# Altium project Carte_Mere.PrjPcb
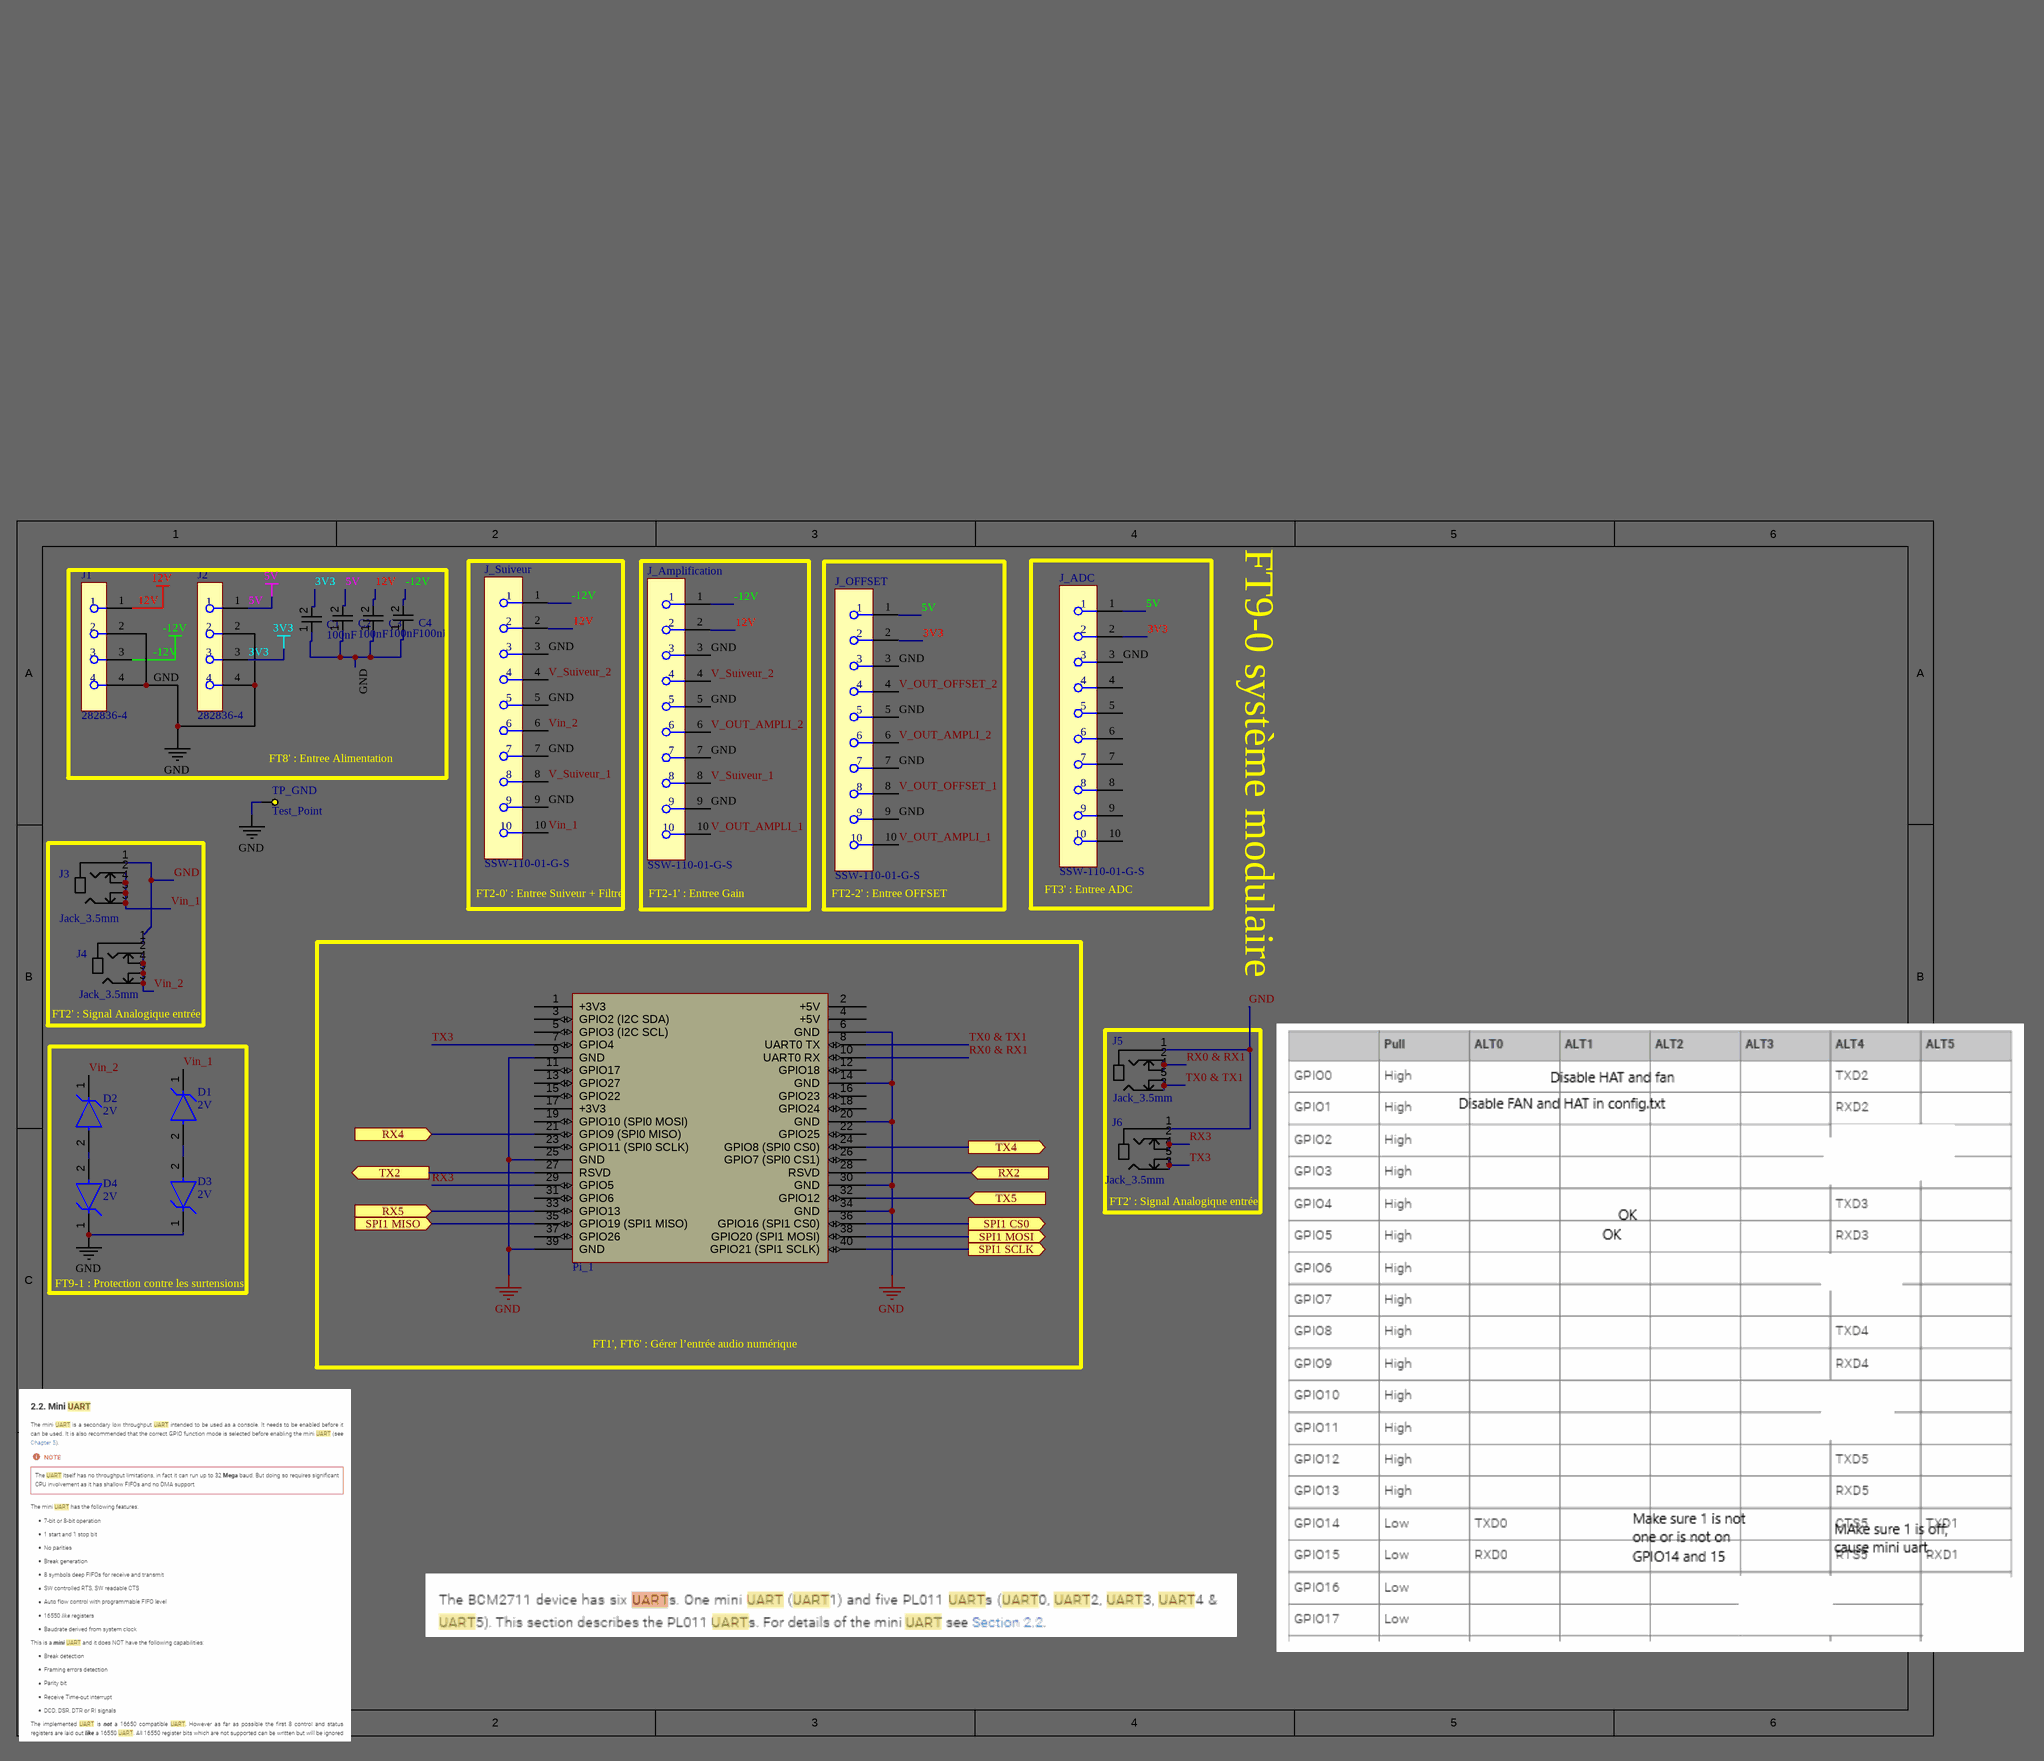
[diagram p0: CarteMere.SchDoc]
CAGE_CODE: ?????; CONTRACT_NUMBER: <CONTRACT NO>; DOC_NO_ASSY_DWG: <ASSY DWG NO>; DOC_NO_BOM: <BOM DOC NO>; DOC_NO_FAB_DWG: <FAB DWG NO>; DOC_NO_SCH_DWG: <SCH DWG NO>; PCB_2_DEC_TOL: +/-.01; PCB_3_DEC_TOL: +/-.010; PCB_ANG_TOL: +/-1/2; PCB_ASSEMBLY_NO: <PCB ASSY NO>; PCB_CHECKER: - -----; PCB_CHECKER_APP_DATE: --/--/----; PCB_DESIGNER: - -----; PCB_DESIGNER_APP_DATE: --/--/----; PCB_DWG_NO: <PCB DWG NO>; PCB_ENGINEER: - -----; PCB_ENGINEER_APP_DATE: --/--/----; PCB_PART_NUMBER: <PCB PN>; PCB_REV: A; SCH_REV: A
1 sheet, 20 parts. Net scope: flat (ports and power ports of the same name join across sheets).
Board file: CarteMere.PcbDoc

## Sheet CarteMere.SchDoc
size B; SheetNumber: 1; SheetTotal: 1; ENG_APP_DATE: --/--/--; DSN_APP_DATE: --/--/--; CHK_APP_DATE: --/--/--

### Parts
C1  value 100nF  [Cap_6.0%2A2.5%2A6mm]  (hidden comment: Cap_6.0*2.5*6mm)
C2  value 100nF  [Cap_6.0%2A2.5%2A6mm]  (hidden comment: Cap_6.0*2.5*6mm)
C3  value 100nF  [Cap_6.0%2A2.5%2A6mm]  (hidden comment: Cap_6.0*2.5*6mm)
C4  value 100nF  [Cap_6.0%2A2.5%2A6mm]  (hidden comment: Cap_6.0*2.5*6mm)
D1  value 2V  [Zener_Diode]  (hidden comment: ZENER_Diode)
D2  value 2V  [Zener_Diode]  (hidden comment: ZENER_Diode)
D3  value 2V  [Zener_Diode]  (hidden comment: ZENER_Diode)
D4  value 2V  [Zener_Diode]  (hidden comment: ZENER_Diode)
J1  282836-4  [FP-282836-4-MFG]
J2  282836-4  [FP-282836-4-MFG]
J3  Jack_3.5mm  [Jack_3.5mm_PCB_ 3poles/stereo]
J4  Jack_3.5mm  [Jack_3.5mm_PCB_ 3poles/stereo]
J5  Jack_3.5mm  [Jack_3.5mm_PCB_ 3poles/stereo]
J6  Jack_3.5mm  [Jack_3.5mm_PCB_ 3poles/stereo]
J_ADC  SSW-110-01-G-S  [FP-SSW-110-01-G-S-MFG]
J_Amplification  SSW-110-01-G-S  [FP-SSW-110-01-G-S-MFG]
J_OFFSET  SSW-110-01-G-S  [FP-SSW-110-01-G-S-MFG]
J_Suiveur  SSW-110-01-G-S  [FP-SSW-110-01-G-S-MFG]
Pi_1  GPIO_conn_RaspberyPi  [Pi_20x2_pins_Male]  (value not drawn)
TP_GND  Test_Point  [Test_Point_Hook]

### Blocks framed on the sheet
FT8' : Entree Alimentation: C1-C4 J1 J2
FT2-0' : Entree Suiveur + Filtre: J_Suiveur
FT2-1' : Entree Gain: J_Amplification
FT2-2' : Entree OFFSET: J_OFFSET
FT3' : Entree ADC: J_ADC
FT2' : Signal Analogique entrée: J3 J4
FT1', FT6' : Gérer l’entrée audio numérique: Pi_1
FT2' : Signal Analogique entrée: J5 J6
FT9-1 : Protection contre les surtensions: D1-D4

### Ports
RX2 (in), RX4 (in), RX5 (in), SPI1 CS0 (out), SPI1 MISO (in), SPI1 MOSI (out), SPI1 SCLK (out), TX2 (out), TX4 (out), TX5 (in)

### Nets
3V3: C1.2 J2.3 J_ADC.2 J_OFFSET.2
5V: C2.2 J2.1 J_ADC.1 J_OFFSET.1
12V: C3.2 J1.1 J_Amplification.2 J_Suiveur.2
-12V: C4.2 J1.3 J_Amplification.1 J_Suiveur.1
GND: C1.1 C2.1 C3.1 C4.1 D3.1(C) D4.1(C) J1.2 J1.4 J2.2 J2.4 J3.1 J4.1 J5.1 J6.1 J_ADC.3 J_Amplification.3 J_Amplification.5 J_Amplification.7 J_Amplification.9 J_OFFSET.3 J_OFFSET.5 J_OFFSET.7 J_OFFSET.9 J_Suiveur.3 J_Suiveur.5 J_Suiveur.7 J_Suiveur.9 Pi_1.6(GND) Pi_1.9(GND) Pi_1.14(GND) Pi_1.20(GND) Pi_1.25(GND) Pi_1.30(GND) Pi_1.34(GND) Pi_1.39(GND) TP_GND.Tp?
RX0 & RX1: J5.2 J5.4 Pi_1.10(UART0_RX)
RX3: J6.2 J6.4 Pi_1.29(GPIO5)
TX0 & TX1: J5.3 J5.5 Pi_1.8(UART0_TX)
TX3: J6.3 J6.5 Pi_1.7(GPIO4)
V_OUT_AMPLI_1: J_Amplification.10 J_OFFSET.10
V_OUT_AMPLI_2: J_Amplification.6 J_OFFSET.6
V_OUT_OFFSET_1: J_OFFSET.8
V_OUT_OFFSET_2: J_OFFSET.4
V_Suiveur_1: J_Amplification.8 J_Suiveur.8
V_Suiveur_2: J_Amplification.4 J_Suiveur.4
Vin_1: D1.1(C) J3.2 J3.3 J3.4 J3.5 J_Suiveur.10
Vin_2: D2.1(C) J4.2 J4.3 J4.4 J4.5 J_Suiveur.6
NetD1_2: D1.2(A) D3.2(A)
NetD2_2: D2.2(A) D4.2(A)
NetPi_1_21: Pi_1.21(GPIO9_(SPI0_MISO)) ; port RX4
NetPi_1_24: Pi_1.24(GPIO8_(SPI0_CS0)) ; port TX4
NetPi_1_27: Pi_1.27(RSVD) ; port TX2
NetPi_1_28: Pi_1.28(RSVD) ; port RX2
NetPi_1_32: Pi_1.32(GPIO12) ; port TX5
NetPi_1_33: Pi_1.33(GPIO13) ; port RX5
NetPi_1_35: Pi_1.35(GPIO19_(SPI1_MISO)) ; port SPI1 MISO
NetPi_1_36: Pi_1.36(GPIO16_(SPI1_CS0)) ; port SPI1 CS0
NetPi_1_38: Pi_1.38(GPIO20_(SPI1_MOSI)) ; port SPI1 MOSI
NetPi_1_40: Pi_1.40(GPIO21_(SPI1_SCLK)) ; port SPI1 SCLK

Not connected (* = marked no-connect by the designer): J_ADC 4 5 6 7 8 9 10; Pi_1 1(+3V3) 2(+5V) 3(GPIO2_(I2C_SDA)) 4(+5V) 5(GPIO3_(I2C_SCL)) 11(GPIO17) 12(GPIO18) 13(GPIO27) 15(GPIO22) 16(GPIO23) 17(+3V3) 18(GPIO24) 19(GPIO10_(SPI0_MOSI)) 22(GPIO25) 23(GPIO11_(SPI0_SCLK)) 26(GPIO7_(SPI0_CS1)) 31(GPIO6) 37(GPIO26)

### Notes on the sheet
- FT9-0 système modulaire
- DWG. NO.
- REV.
- SHT.
- THIS DOCUMENT AND THE DATA DISCLOSED HEREIN OR HEREWITH IS THE PROPERTY OF ALTIUM LIMITED AND MAY BE FREELY DISTRIBUTED IN WHOLE. NO RIGHTS ARE RESERVED OR EXPRESS OR IMPLIED WARANTEE GIVEN.
- REVISION
- DESCRIPTION
- DATE
- APPROVED
- ENG:
- APPROVALS
- PROJECT
- DSN:
- CHK:
- REFERENCE DOCUMENTS
- PROJECT REVISION:
- TITLE
- DOCUMENT REVISION:
- DESIGN ITEM:
- BOM:
- FAB DWG:
- PCB DWG:
- ASSY DWG:
- SCALE:
- SIZE
- B
- CAGE CODE
- FILE NAME
- DWG NO.
- SHEET
- OF
- REV

### Library data of the parts
J1 J2 = CMP-03790-46505329-1: 282836-4 Connector, Terminal Block; Wire Receptacle; 4 Pos.; 16-30 AWG; 0.197 in. CL; Sid; Manufacturer Lifecycle Status: ACTIVE; Number of Contacts: 4; Max Supply Voltage (AC): 300V; Wire Gauge (Min): 30AWG; Max Current Rating: 13.5A; Approvals: UL; Number of Levels: 1; Thread Size: M3; Connector System: Wire-to-Board; Voltage Rating (DC): 250V; Pitch: 5mm; Plating: Brass; Tail Length: 3.5mm; Housing Color: Green; Number of Rows: 1; REACH SVHC: Unknown; Lead Pitch: 5mm; Depth: 8.2mm; Lead Free: Lead Free; Mount: Through Hole; Contact Plating: Tin; Housing Material: Polyamide; ELV: Compliant; Radiation Hardening: No; RoHS: Compliant; Number of Circuits: 4; Voltage Rating: 300V; Contact Material: Brass; NexarPartId: 46505329; Current Rating: 13.5A; Max Voltage Rating (AC): 300V; Orientation: Straight; Number of Positions: 4; Lifecycle Status: Production; Operating Supply Voltage: 300V; Connector Type: Receptacle; Number of Positions Per Level: 4; Flammability Rating: UL94 V-0; Packaging: Bulk; Termination: Screw, Solder; Wire Gauge (Max): 30AWG; Number of Poles: 4; Width: 10mm; Voltage Rating (AC): 250V; Length: 20mm; Current: 13.5A; Voltage: 300V; Color: Green
J3-J6 = Jack_3.5mm_PCB_3pole/stereo: Connecteur Jack 3,5 mm Prise femelle Lumberg, Montage sur CI
J_ADC J_Amplification J_OFFSET J_Suiveur = CMP-1272-00002-2: Manufacturer Lifecycle Status: PRODUCTION; NexarPartId: 296065; Gender: Receptacle; Number of Contacts: 10; Contact Resistance: 10mΩ; Voltage Rating (AC): 465V; Connector Type: Socket; Voltage Rating: 550V; Voltage Rating (DC): 655V; Pitch: 2.54mm; Max Current Rating: 6.9A; Lead Length: 2.64mm; System: Connector; Depth: 2.41mm; Termination: Solder; Contact Material: Bronze; Length: 25.91mm; REACH SVHC: No SVHC; Min Operating Temperature: -55°C; Max Voltage Rating (AC): 550V; Color: Black; Lead Pitch: 2.54mm; Packaging: Bulk; Lead Free: Lead Free; Orientation: Vertical; Housing Color: Black; Lifecycle Status: Production; Contact Plating: Gold; Radiation Hardening: No; Current Rating: 6.9A; Number of Positions: 10; Max Operating Temperature: 125°C; Number of Rows: 1; RoHS: Compliant
Pi_1 = GPIO_conn_RaspberyPi: System: Connector